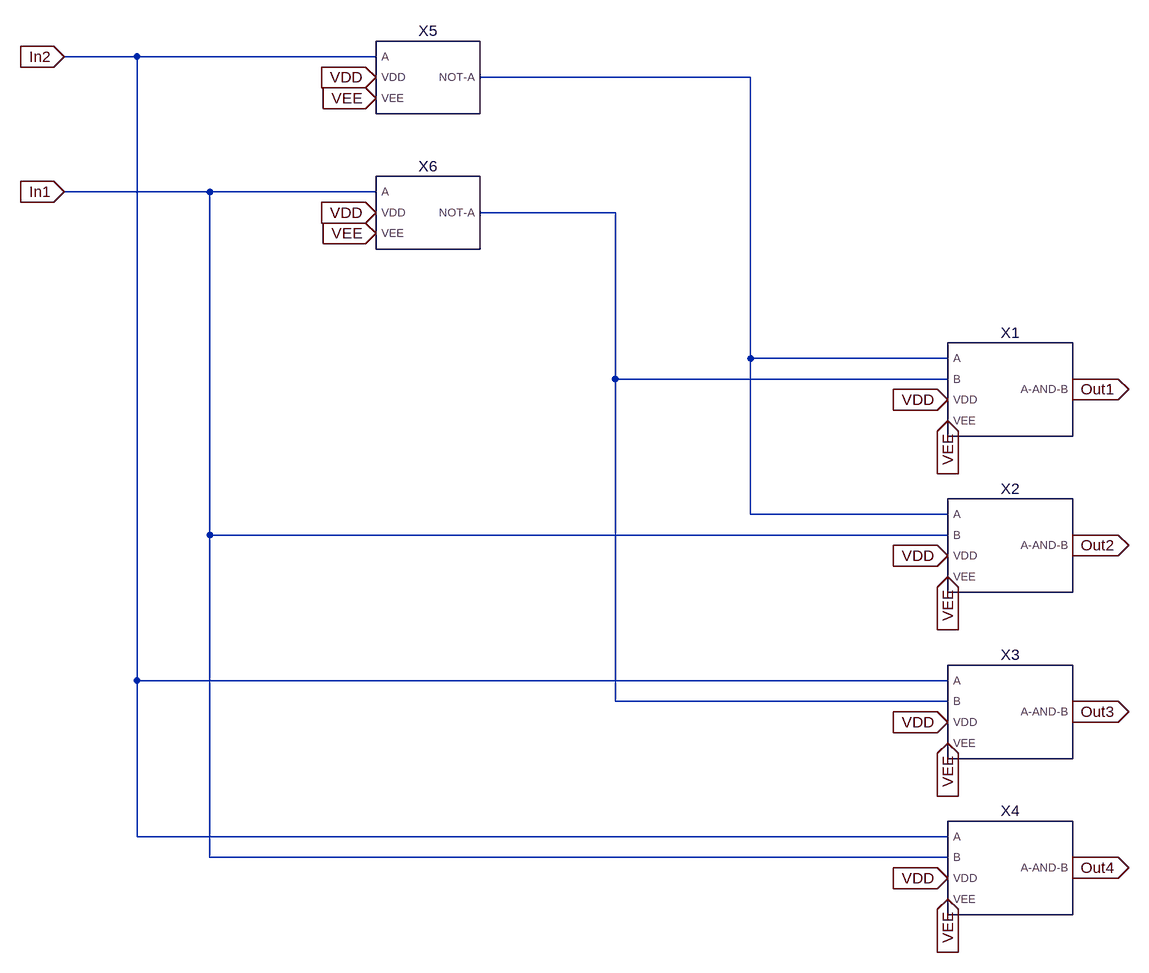
[diagram p0: schematic 2_to_4_Decoder_Symbol.asc]
2_to_4_Decoder_Symbol.asc, the LTspice schematic file:
Version 4
SHEET 1 880 1004
WIRE -752 -352 -864 -352
WIRE -384 -352 -752 -352
WIRE 192 -320 -224 -320
WIRE -640 -144 -864 -144
WIRE -384 -144 -640 -144
WIRE -16 -112 -224 -112
WIRE 192 112 192 -320
WIRE 496 112 192 112
WIRE -16 144 -16 -112
WIRE 496 144 -16 144
WIRE 192 352 192 112
WIRE 496 352 192 352
WIRE -640 384 -640 -144
WIRE 496 384 -640 384
WIRE -752 608 -752 -352
WIRE 496 608 -752 608
WIRE -16 640 -16 144
WIRE 496 640 -16 640
WIRE -752 848 -752 608
WIRE 496 848 -752 848
WIRE -640 880 -640 384
WIRE 496 880 -640 880
FLAG -384 -320 VDD
IOPIN -384 -320 In
FLAG -384 -112 VDD
IOPIN -384 -112 In
FLAG 496 176 VDD
IOPIN 496 176 In
FLAG 496 416 VDD
IOPIN 496 416 In
FLAG 496 672 VDD
IOPIN 496 672 In
FLAG 496 912 VDD
IOPIN 496 912 In
FLAG -384 -288 VEE
IOPIN -384 -288 In
FLAG -384 -80 VEE
IOPIN -384 -80 In
FLAG 496 208 VEE
IOPIN 496 208 In
FLAG 496 448 VEE
IOPIN 496 448 In
FLAG 496 704 VEE
IOPIN 496 704 In
FLAG 496 944 VEE
IOPIN 496 944 In
FLAG -864 -352 In2
IOPIN -864 -352 In
FLAG -864 -144 In1
IOPIN -864 -144 In
FLAG 688 160 Out1
IOPIN 688 160 Out
FLAG 688 400 Out2
IOPIN 688 400 Out
FLAG 688 656 Out3
IOPIN 688 656 Out
FLAG 688 896 Out4
IOPIN 688 896 Out
SYMBOL 2_Input_AND_Gate_Symbol 592 160 R0
SYMATTR InstName X1
SYMBOL 2_Input_AND_Gate_Symbol 592 400 R0
SYMATTR InstName X2
SYMBOL 2_Input_AND_Gate_Symbol 592 656 R0
SYMATTR InstName X3
SYMBOL 2_Input_AND_Gate_Symbol 592 896 R0
SYMATTR InstName X4
SYMBOL Inverter_Gate_Symbol -304 -320 R0
SYMATTR InstName X5
SYMBOL Inverter_Gate_Symbol -304 -112 R0
SYMATTR InstName X6

The netlist it stands for:
* 2_to_4_Decoder_Symbol.asc
XX1 N001 N002 VDD VEE Out1 2_Input_AND_Gate_Symbol  ; pins A B VDD VEE A-AND-B
XX2 N001 In1 VDD VEE Out2 2_Input_AND_Gate_Symbol  ; pins A B VDD VEE A-AND-B
XX3 In2 N002 VDD VEE Out3 2_Input_AND_Gate_Symbol  ; pins A B VDD VEE A-AND-B
XX4 In2 In1 VDD VEE Out4 2_Input_AND_Gate_Symbol  ; pins A B VDD VEE A-AND-B
XX5 In2 VDD VEE N001 Inverter_Gate_Symbol  ; pins A VDD VEE NOT-A
XX6 In1 VDD VEE N002 Inverter_Gate_Symbol  ; pins A VDD VEE NOT-A
.backanno
.end